# EAGLE design Flex-It (EAGLE 7.2.0)
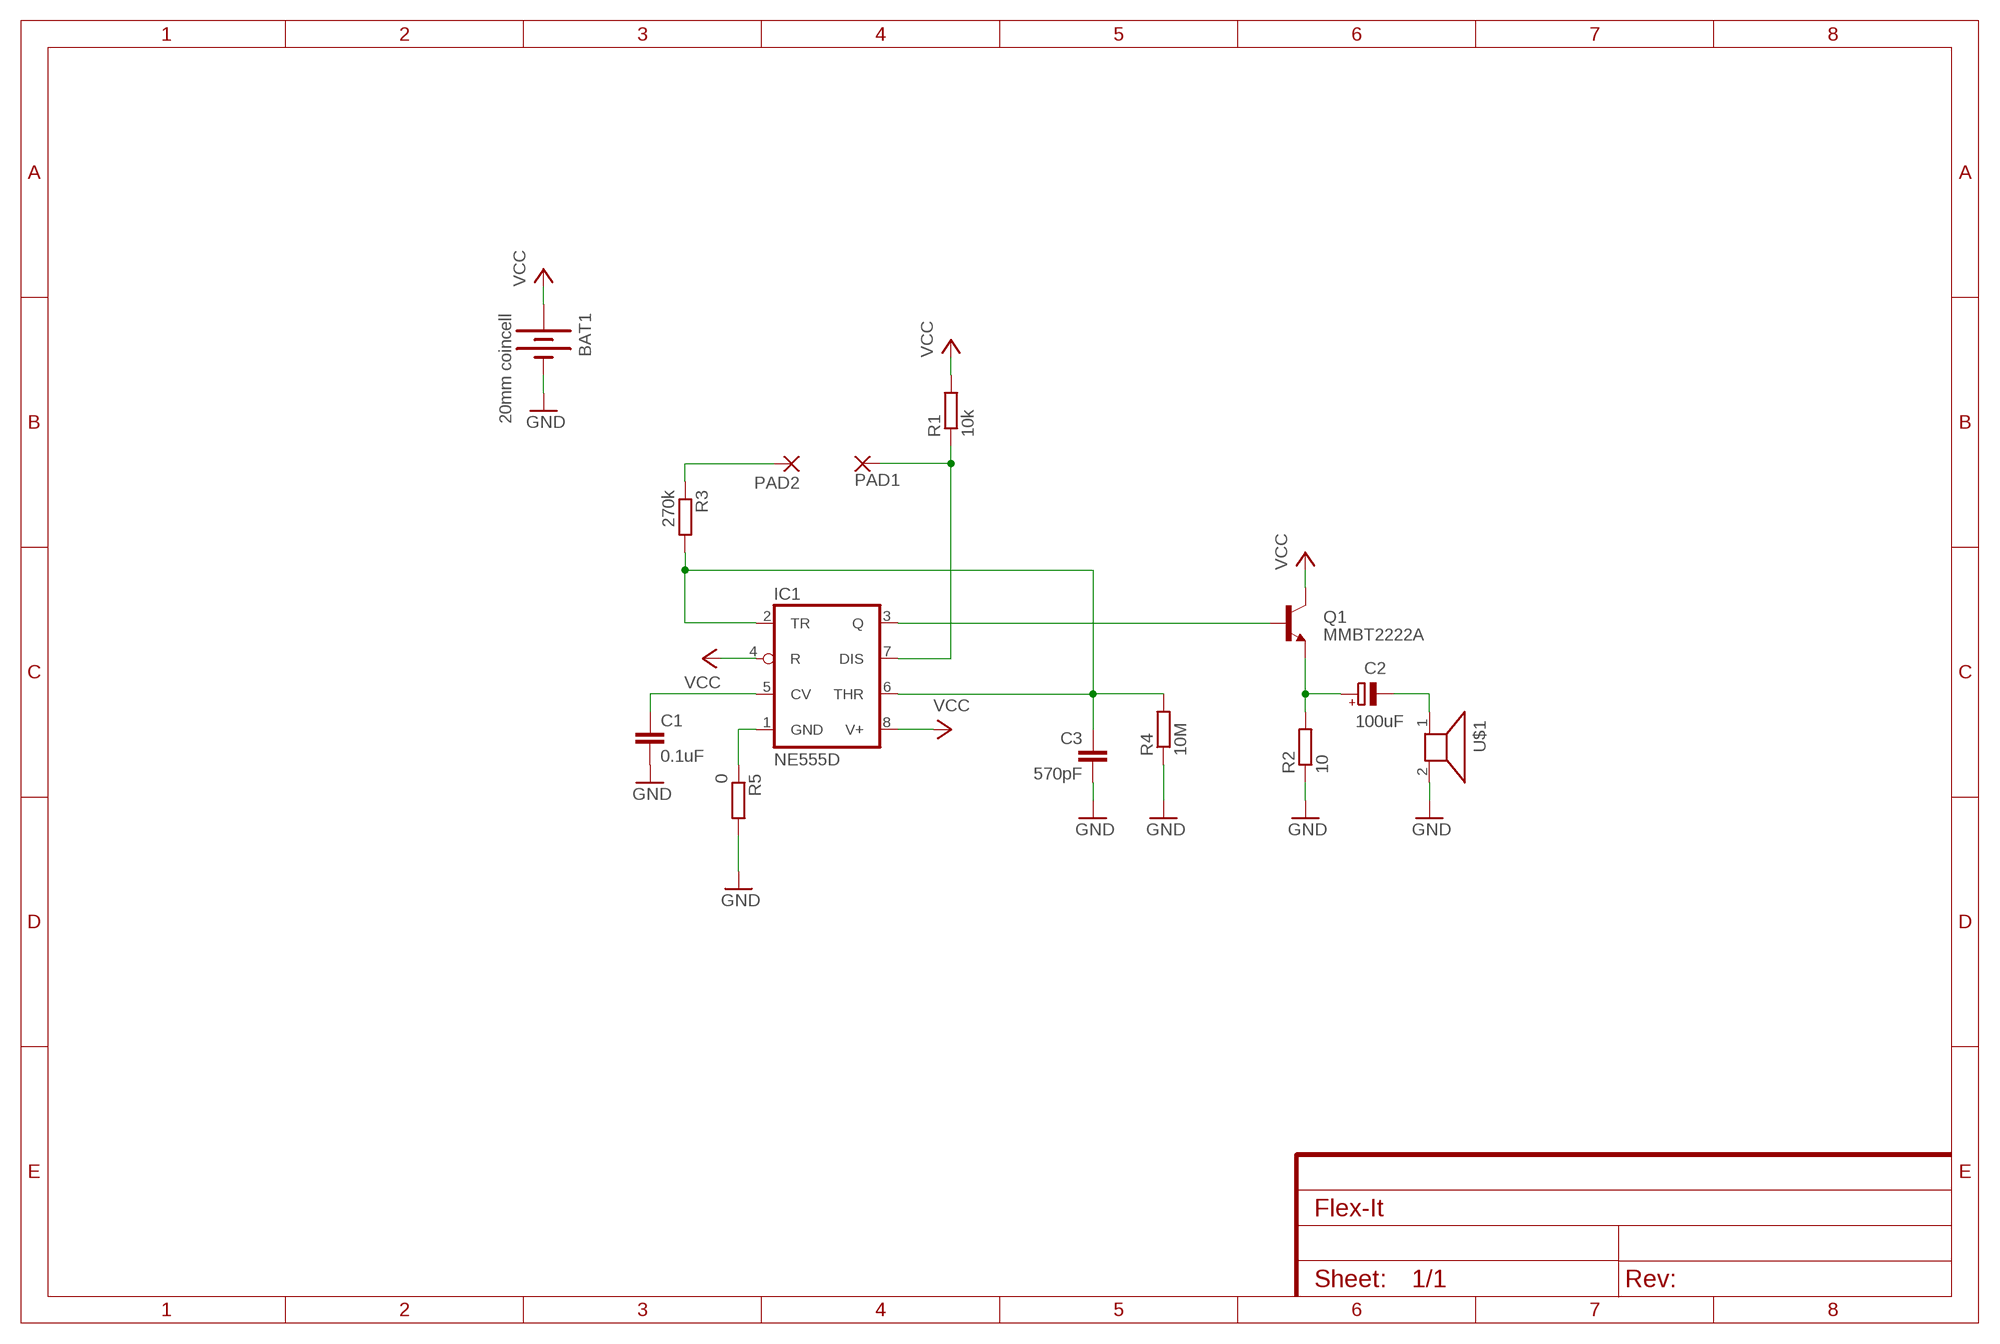
[diagram p0: schematic, sheet 1]

## Parts
BAT1  20mm coincell  BATTERY20MM_4LEGS  [BATTCON_20MM_4LEGS]
C1  0.1uF  C-EUC1206K  [C1206K]
C2  100uF  CPOL-EUSMCB  [SMC_B]
C3  570pF  C-EUC1206K  [C1206K]
IC1  NE555D  [SO08]
PAD1  WIREPADSMD1,27-254  [SMD1,27-2,54]
PAD2  WIREPADSMD1,27-254  [SMD1,27-2,54]
Q1  MMBT2222A  TRANSISTOR_NPNMMBT2222A  [SOT23-3]
R1  10k  R-EU_R1206  [R1206]
R2  10  R-EU_R1206  [R1206]
R3  270k  R-EU_R1206  [R1206]
R4  10M  R-EU_R1206  [R1206]
R5  0  R-EU_R1206  [R1206]
U$1  PS603SPK  [PS603]

## Nets
GND: BAT1.2(-) C1.2 C3.2 IC1.1(GND) R2.1 R4.1 R5.1 R5.2 U$1.2
N$1: C1.1 IC1.5(CV)
N$2: C3.1 IC1.2(TR) IC1.6(THR) R3.2 R4.2
N$3: IC1.3(Q) Q1.1(B)
N$4: C2.- U$1.1
N$5: C2.+ Q1.2(E) R2.2
TOUCH1: IC1.7(DIS) PAD1.1(P) R1.1
TOUCH2: PAD2.1(P) R3.1
VCC: BAT1.1(+) BAT1.3(+) BAT1.P$1(+) BAT1.P$2(+) IC1.4(R) IC1.8(V+) Q1.3(C) R1.2

## Library data of the parts
BAT1 = simbits:BATTERY: Battery Holders Various common sizes : AA, AAA, 20mm coin cell and 12mm coin cell. 20MM_4LEGS, BATT-10373; DIGIKEY: BK-912-CT-ND; PROD_ID: BATT-10373
C1 C3 = rcl:C-EU: CAPACITOR, European symbol
C2 = rcl:CPOL-EU: POLARIZED CAPACITOR, European symbol
IC1 = adafruit:*555: TIMER Changed DIP package to have round (not oval) pin pads http://www.ladyada.net/library/pcb/eaglelibrary.html
PAD1 PAD2 = wirepad:WIREPAD: Wire PAD connect wire on PCB
Q1 = SparkFun-DiscreteSemi:TRANSISTOR_NPN: Generic NPN BJT MMBT2222A - TRANS-08049 (SOT-23, 1A 40V) MPSA42 - TRANS-09116 (SOT-23, 500mA 300V) MMBT5088LT1G - TRANS-11160 (SOT-23, 50 mA 30V) BC547 - COM-08928 <http://www.sparkfun.com/products/8928> (TO-92 45V 100mA) (1.Collector 2.Base 3.Emitter) 2N3904 - COM-00521 <http://www.sparkfun.com/products/521> (TO-92 40V 200mA) (1.Emitter 2.Base 3.Collector) P2N2222A - COM-12852 <http://www.sparkfun.com/products/12852> (TO-92 40V 600mA) (1.Collector 2.Base 3.Emitter); PROD_ID: TRANS-08049
R1-R5 = rcl:R-EU_: RESISTOR, European symbol
U$1 = adafruit:PS603: PS603 Small 8 ohm speaker, from Mouser. Can SMT solder to board http://www.ladyada.net/library/pcb/eaglelibrary.html

## Board
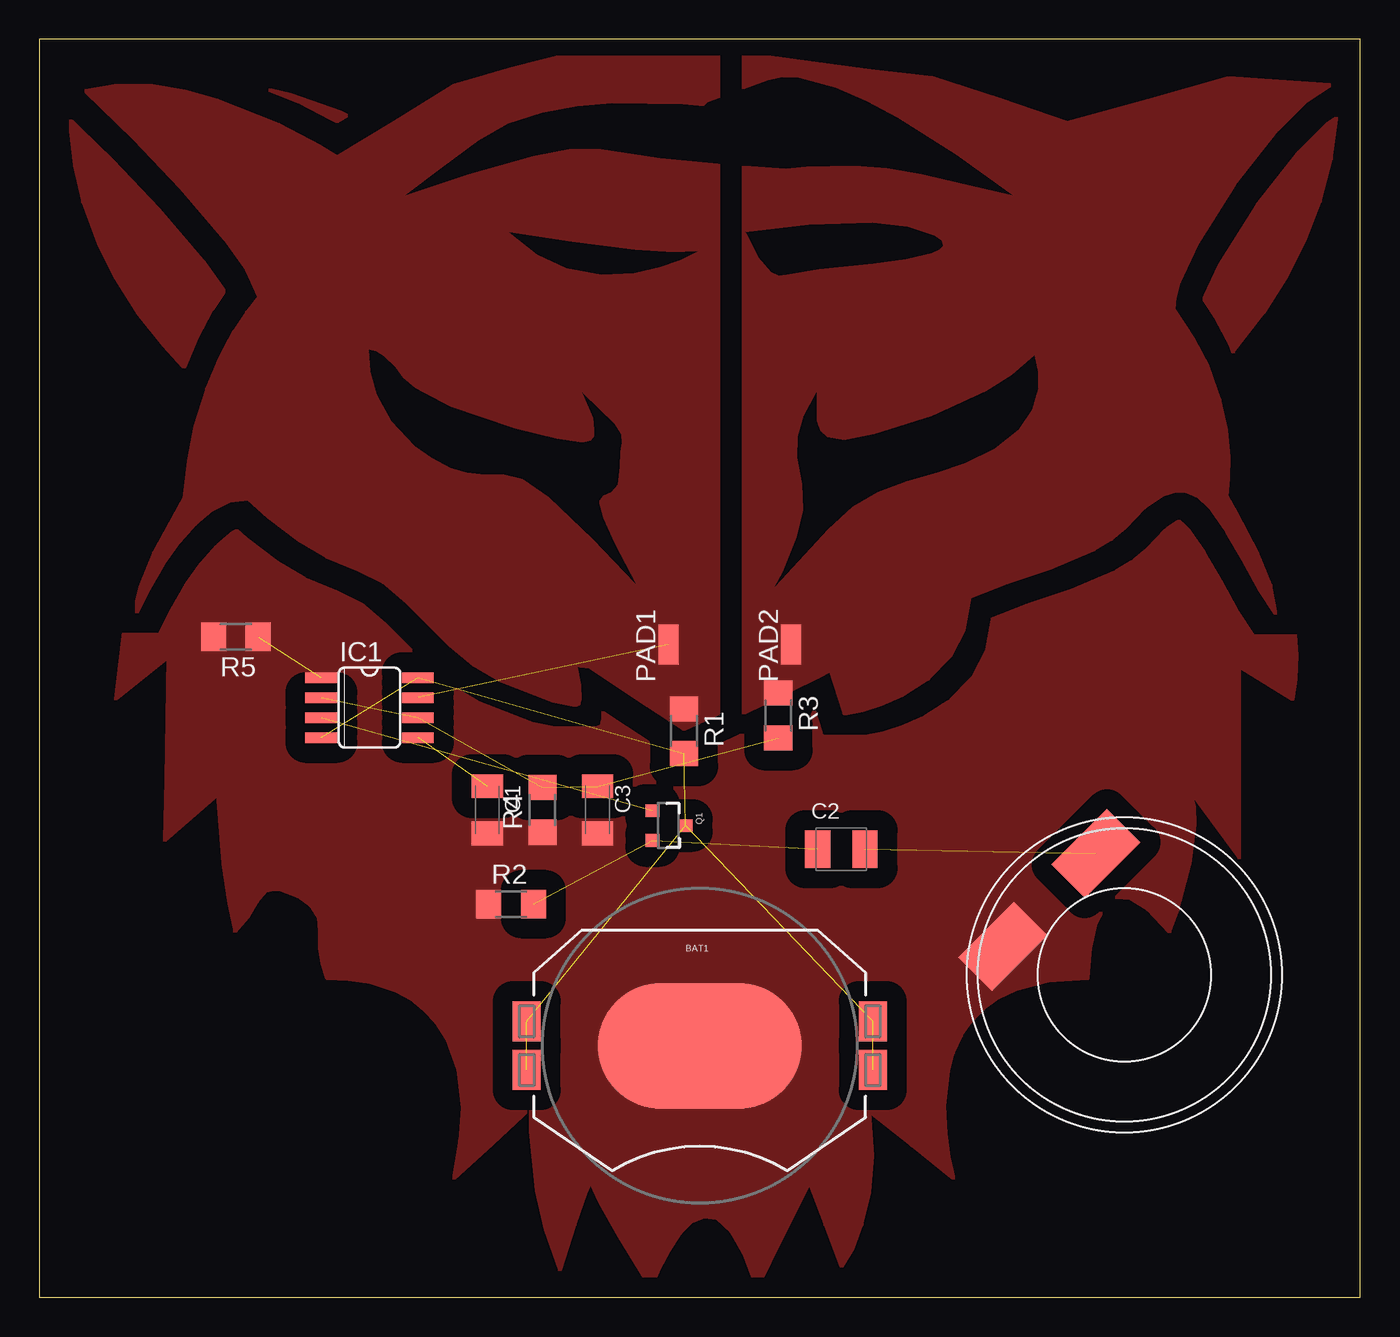
[diagram p1: board, top side]

Size 84 x 80 mm. Coordinates in mm from the lower left corner, seen from the top.
Outline: 0,0 84,0 84,80 0,80 0,0
Copper layers (1*16): Top 0.035mm / dielectric 1.5mm / Bottom 0.035mm
Design rules "default": minimum track width 10mil, minimum drill 0.6mm, track to track 8mil, track to pad 8mil, pad to pad 8mil, via to via 8mil, smd to smd 8mil, copper to edge 40mil, drill to drill 8mil, minimum pad ring 10mil, minimum via ring 8mil, stop-mask expansion 4mil, vias tented up to drill 0mil, thermal gap 10mil

### Footprints (pad centres in the part's own frame; a part is rotated, then mirrored left to right if it is on the bottom)
BATTCON_20MM_4LEGS = smd 1.778 x 2.54: 1 -11,1.55; 3 11,1.55; P$1 -11,-1.55; P$2 11,-1.55 | smd 13 x 8: 2 0,0
C1206K = smd 1.5 x 2: 1 -1.5,0; 2 1.5,0
SMC_B = smd 1.6 x 2.4: + -1.5,0; - 1.5,0
SO08 = smd 0.66 x 2.032: 1 -1.905,-3.073; 2 -0.635,-3.073; 3 0.635,-3.073; 4 1.905,-3.073; 5 1.905,3.073; 6 0.635,3.073; 7 -0.635,3.073; 8 -1.905,3.073
SMD1,27-2,54 = smd 1.27 x 2.54: 1 0,0
SOT23-3 = smd 0.8 x 0.9: 1 -0.95,-1; 2 0.95,-1; 3 0,1.1
R1206 = smd 1.6 x 1.803: 1 -1.422,0; 2 1.422,0
PS603 = smd 5 x 3: 1 -4.184,-6.738; 2 4.184,-6.738

### Placement (x,y rotation side)
BAT1  42,16 0 top
C1  28.5,31 270 top
C2  51,28.5 0 top
C3  35.5,31 270 top
IC1  21,37.5 270 top
PAD1  40,41.5 0 top
PAD2  47.8,41.5 0 top
Q1  40,30 270 top
R1  41,36 270 top
R2  30,25 0 top
R3  47,37 270 top
R4  32,31 90 top
R5  12.5,42 180 top
U$1  69,20.5 225 top

### Tracks (layer width: path | path; a pad name or v marks a point on that pad's centre or on a via)
GND  (1 unrouted)
  pour Top (isolate 1.27, rank 6, no thermals): 38.38,79.6 35.55,79.54 33.3,79.26 28.89,77.95 24.57,76.39 20.29,74.79 19.16,75.32 15.97,76.44 13.86,76.94 11.41,77.38 9.2,77.57 6.79,77.63 4.5,77.48 2.17,77.19 2,75.79 2,74.17 2.25,72.01 2.79,69.67 3.79,67.01 4.88,64.82 6.36,62.48 7.92,60.54 9.76,58.51 9.47,57.57 8.91,54.85 8.66,51.01 7.79,49.6 7.09,48.72 6.59,48.01 6.2,47.13 5.79,45.48 5.38,42.6 4.86,38.04 8.2,40.72 8.13,36.82 8.06,32.94 7.97,29.04 11.36,31.98 11.7,27.6 12.07,25.04 12.46,23.26 13.27,24.2 13.82,25.17 14.41,25.86 14.86,25.98 15.38,25.95 16.45,25.51 17.29,24.92 17.75,24.17 17.82,23.26 17.82,22.23 17.98,21.26 18.29,20.32 19.66,20.26 21.07,20.07 22.7,19.51 23.64,19.01 24.48,18.32 25.25,17.48 25.95,16.42 26.64,14.51 26.91,12.04 26.75,9.95 26.34,7.54 28.82,9.79 31.25,12.04 31.25,10.54 31.64,6.79 32.2,4.32 33.1,1.73 34.05,4.61 34.77,6.7 34.98,7.26 35.08,7.32 35.66,6.07 36.88,3.88 38.91,0.6 39.41,1.85 40.01,2.97 40.76,4.1 41.48,4.82 42.26,5.16 43.09,5.04 44.01,4.19 44.35,3.6 44.83,2.79 45.63,0.6 47.3,3.98 48.98,7.32 49.98,4.63 51.02,1.94 51.73,3.16 52.3,4.63 52.8,6.69 52.98,9 52.8,11.81 55.48,9.69 58.17,7.53 57.84,8.91 57.65,10.35 57.55,12.16 57.8,14.44 58.12,15.56 58.62,16.65 59.23,17.53 59.98,18.34 60.95,19.06 62.12,19.62 64.14,20.15 66.67,20.31 66.83,22.22 67.17,23.81 67.86,25.06 68.53,25.47 69.36,25.41 70.48,24.69 71.86,23.25 72.36,24.59 73.17,27.62 73.48,30.06 73.45,31.18 73.2,32.18 76.33,27.93 76.33,40.11 79.7,38.02 79.89,39.33 79.95,40.8 79.86,42.63 79.42,44.79 78.53,47.01 77.36,48.85 75.67,50.6 75.72,52.85 75.64,54.63 75.22,56.51 74.53,58.51 75.92,60.1 77.89,62.66 79.22,64.82 80.5,67.32 81.44,69.7 82.14,72.39 82.47,74.94 82.59,77.69 81.59,77.97 80.16,78.06 77.91,78 73.28,77.28 68.72,76.16 64.22,74.78 63.01,75.57 61.48,76.35 59.31,77.22 56.91,78.01 54.01,78.63 51.45,79.04 48.53,79.26 44.35,79.41 43.45,79.44
N$1  (1 unrouted)
N$2  (4 unrouted)
N$3  (1 unrouted)
N$4  (1 unrouted)
N$5  (2 unrouted)
N$6
  cutout Top (isolate 0.406): 44.91,67.74 48.94,68.22 52.98,68.33 55.2,68.09 56.92,67.52 57.38,67.18 57.45,66.88 57.23,66.62 56.73,66.39 55.12,66.02 53.02,65.73 49.58,65.37 47.51,65.02 47.03,64.97 46.58,65.2 45.74,66.16 44.92,67.74
N$7
  cutout Top (isolate 0.406): 29.86,67.74 33.85,67.12 37.87,66.62 40.3,66.45 41.88,66.54 40.73,65.97 39.45,65.5 37.8,65.13 35.74,65.03 33.52,65.44 31.68,66.29 29.88,67.73
N$8
  cutout Top (isolate 0.406): 42.27,75.75 40.9,75.88 36.42,75.94 34.23,75.74 32,75.34 29.82,74.63 27.93,73.56 25.61,71.83 23.29,70.09 27.3,71.42 31.36,72.56 33.83,73.03 35.53,73.03 39.51,72.45 43.49,72.07 47.49,71.76 48.74,71.89 51.83,71.97 53.92,71.82 56.12,71.43 58.98,70.74 61.88,70.1 58.3,72.67 54.59,75 52.59,76.06 50.65,76.92 48.27,77.56 47.23,77.6 46.37,77.41 42.52,75.99
N$9
  cutout Top: 63.28,59.87 63.52,58.83 63.49,57.74 63.12,56.45 62.27,55.17 60.73,53.96 58.87,53.05 57.09,52.45 55.17,51.9 53.31,51.21 51.73,50.29 50.15,48.87 46.78,45.2 47.28,46.13 48.2,48.34 48.59,50.06 48.52,51.73 48.23,53.41 48.24,54.75 48.63,56.06 49.44,57.54 49.44,55.76 49.63,55.12 50.09,54.69 51.2,54.52 53.12,54.89 56.76,56.05 60.23,57.63 61.84,58.66
N$10
  cutout Top: 34.55,57.52 35.23,55.9 35.33,54.81 35.08,54.47 34.55,54.36 32.85,54.62 30.25,55.24 26.11,56.65 23.89,57.83 23.11,58.48 22.61,59.16 21.89,59.85 21.38,60.18 20.98,60.28 21.07,58.86 21.48,57.4 22.41,55.72 23.91,54.14 24.93,53.4 26.18,52.73 27.2,52.45 28.05,52.35 29.48,52.34 30.75,52.03 32.41,50.89 35.23,48.21 37.91,45.39 36.58,47.93 35.84,49.54 35.56,50.59 35.84,50.98 36.34,51.21 36.78,51.69 36.9,52.83 36.91,53.74 37.02,54.34 36.99,54.86 36.59,55.53 34.55,57.51
TOUCH1  (1 unrouted)
  pour Top (isolate 0.305, rank 5, no thermals): 43.19,79.04 33.8,79.04 30.05,78.1 26.32,77.01 22.64,74.72 18.95,72.51 17.89,73.13 15.22,74.54 11.29,76.1 9.23,76.66 7.17,77.01 5,77.04 2.94,76.7 6.04,73.7 8.99,70.61 11.79,67.33 13.21,65.33 13.99,63.64 13.21,62.64 12.4,61.42 11.51,59.73 10.66,57.76 9.93,55.38 9.49,53.19 9.21,50.78 7.29,47.34 6.42,45.15 6.21,44.27 6.21,43.55 6.95,45.05 7.82,46.54 8.93,48.1 9.93,49.19 10.97,50.1 12.1,50.66 13.28,50.78 14.54,49.66 16.52,48.16 18.3,47.1 20.25,46.32 21.86,45.51 23.41,44.2 26.14,41.48 27.62,40.23 29.23,39.29 32.67,37.95 34.1,37.67 34.3,37.76 34.38,38.04 34.35,38.92 34.1,40.2 35.01,40.11 37.98,38.11 40.99,36.14 43.2,37.17 43.2,79.05
TOUCH2
  pour Top (isolate 0.254, rank 5, no thermals): 44.77,79.04 44.77,37.16 46.08,37.78 49.52,39.47 50.31,39.88 51.2,37.13 52.34,37.35 53.52,37.73 54.91,38.32 56.52,39.35 57.94,40.82 58.78,42.48 59.17,44.57 61.53,45.48 64.28,46.42 67.06,47.58 68.19,48.24 69.06,48.99 70.28,50.24 71.52,51.08 72.25,51.3 72.97,51.27 73.7,50.96 74.41,50.3 75.53,48.71 76.56,46.93 77.64,44.96 78.64,43.46 78.28,45.27 77.44,47.36 76.14,49.83 75.5,50.92 75.62,52.08 75.66,53.42 75.47,55.14 75.06,57.08 74.3,59.2 73.36,60.98 72.14,62.82 72.2,63.57 72.47,64.57 73.62,67.01 75.98,70.79 78.73,74.26 80.55,76.07 82.08,77.07 78.83,77.29 75.64,77.51 70.5,76.07 65.39,74.66 61.12,76.13 56.8,77.51 52.84,77.98 48.85,78.51 44.9,79.04
VCC  (7 unrouted)